# EAGLE design smoothieboard_daugterboard_template (EAGLE 7.2.0)
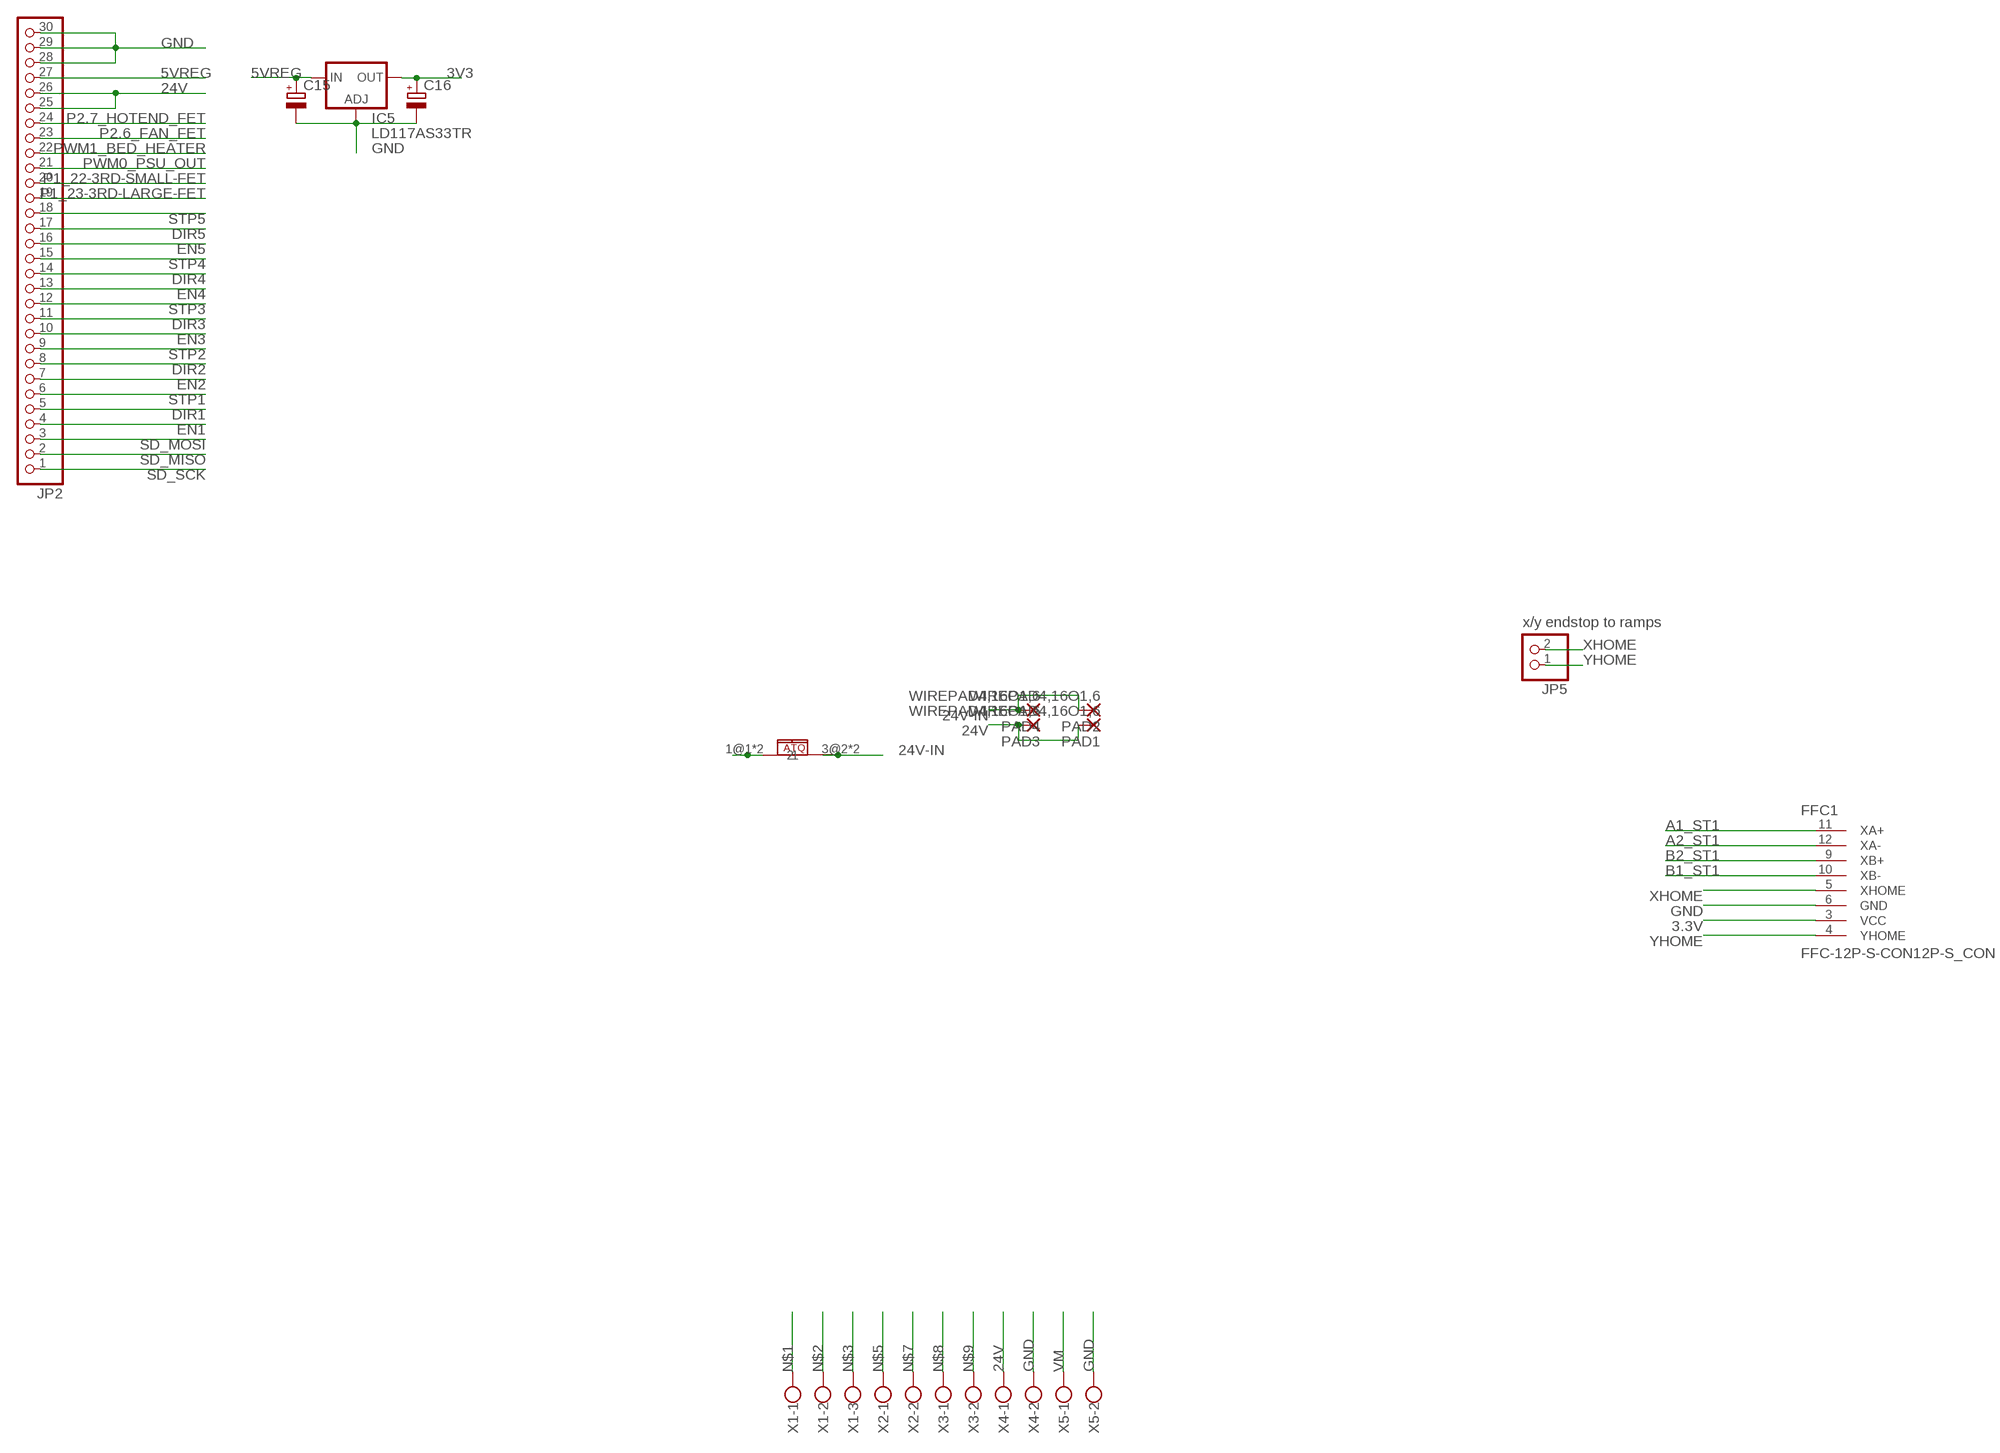
[diagram p0: schematic, sheet 1]

## Parts
C15  CPOL-EUE2.5-7  [E2,5-7]
C16  CPOL-EUE2.5-6  [E2,5-6]
FFC1  FFC-12P-S-CON12P-S_CON  [FFC]
IC5  LD117AS33TR  [SOT223]
JP2  PINHD-1X30  [1X30]
JP5  PINHD-1X2  [1X02]
PAD1  WIREPAD4,16O1,6  [4,16O1,6]
PAD2  WIREPAD4,16O1,6  [4,16O1,6]
PAD3  WIREPAD4,16O1,6  [4,16O1,6]
PAD4  WIREPAD4,16O1,6  [4,16O1,6]
U$7  CQ-121  [CQ121]
X1  W237-103  [W237-103]
X2  W237-102  [W237-102]
X3  W237-102  [W237-102]
X4  W237-102  [W237-102]
X5  W237-102  [W237-102]

## Nets
3.3V: FFC1.3(VCC)
3V3: C16.+ IC5.4(OUT)
5VREG: C15.+ IC5.3(IN) JP2.27
24V: JP2.25 JP2.26 PAD1.1(P) PAD3.1(P) X4.1
24V-IN: PAD2.1(P) PAD4.1(P) U$7.3@2 U$7.4@2
A1_ST1: FFC1.11(XA+)
A2_ST1: FFC1.12(XA-)
B1_ST1: FFC1.10(XB-)
B2_ST1: FFC1.9(XB+)
DIR1: JP2.5
DIR2: JP2.8
DIR3: JP2.11
DIR4: JP2.14
DIR5: JP2.17
EN1: JP2.4
EN2: JP2.7
EN3: JP2.10
EN4: JP2.13
EN5: JP2.16
GND: C15.- C16.- FFC1.6(GND) IC5.1(ADJ) JP2.28 JP2.29 JP2.30 X4.2 X5.2
N$1: X1.1
N$2: X1.2
N$3: X1.3
N$5: X2.1
N$7: X2.2
N$8: X3.1
N$9: X3.2
P1_22-3RD-SMALL-FET: JP2.20
P1_23-3RD-LARGE-FET: JP2.19
P2.6_FAN_FET: JP2.23
P2.7_HOTEND_FET: JP2.24
PWM0_PSU_OUT: JP2.21
PWM1_BED_HEATER: JP2.22
SD_MISO: JP2.2
SD_MOSI: JP2.3
SD_SCK: JP2.1
STP1: JP2.6
STP2: JP2.9
STP3: JP2.12
STP4: JP2.15
STP5: JP2.18
VM: U$7.1@1 U$7.2@1 X5.1
XHOME: FFC1.5(XHOME) JP5.2
YHOME: FFC1.4(YHOME) JP5.1

## Notes on the sheet
- x/y endstop to ramps

## Library data of the parts
C15 C16 = rcl:CPOL-EU: POLARIZED CAPACITOR, European symbol
FFC1 = WeisTek:FFC-12P-S-CON
IC5 = v-reg:LD117A?*: Low drop fixed and adjustable positive voltage regulators 1 A Source: http://www.st.com/stonline/products/literature/ds/7194/ld1117axx.pdf
JP2 = pinhead:PINHD-1X30: PIN HEADER
JP5 = pinhead:PINHD-1X2: PIN HEADER
PAD1-PAD4 = wirepad:WIREPAD: Wire PAD connect wire on PCB
U$7 = Mantech.co.za:CQ-121
X1 = con-wago-500:W237-103: WAGO SCREW CLAMP; MPN: 237-103; OC_FARNELL: unknown; OC_NEWARK: 18M7116
X2-X5 = con-wago-500:W237-102: WAGO SCREW CLAMP; MPN: 237-102; OC_FARNELL: unknown; OC_NEWARK: 70K9898

## Net classes
1 power: width 0.6 mm, clearance 0.305 mm

## Board
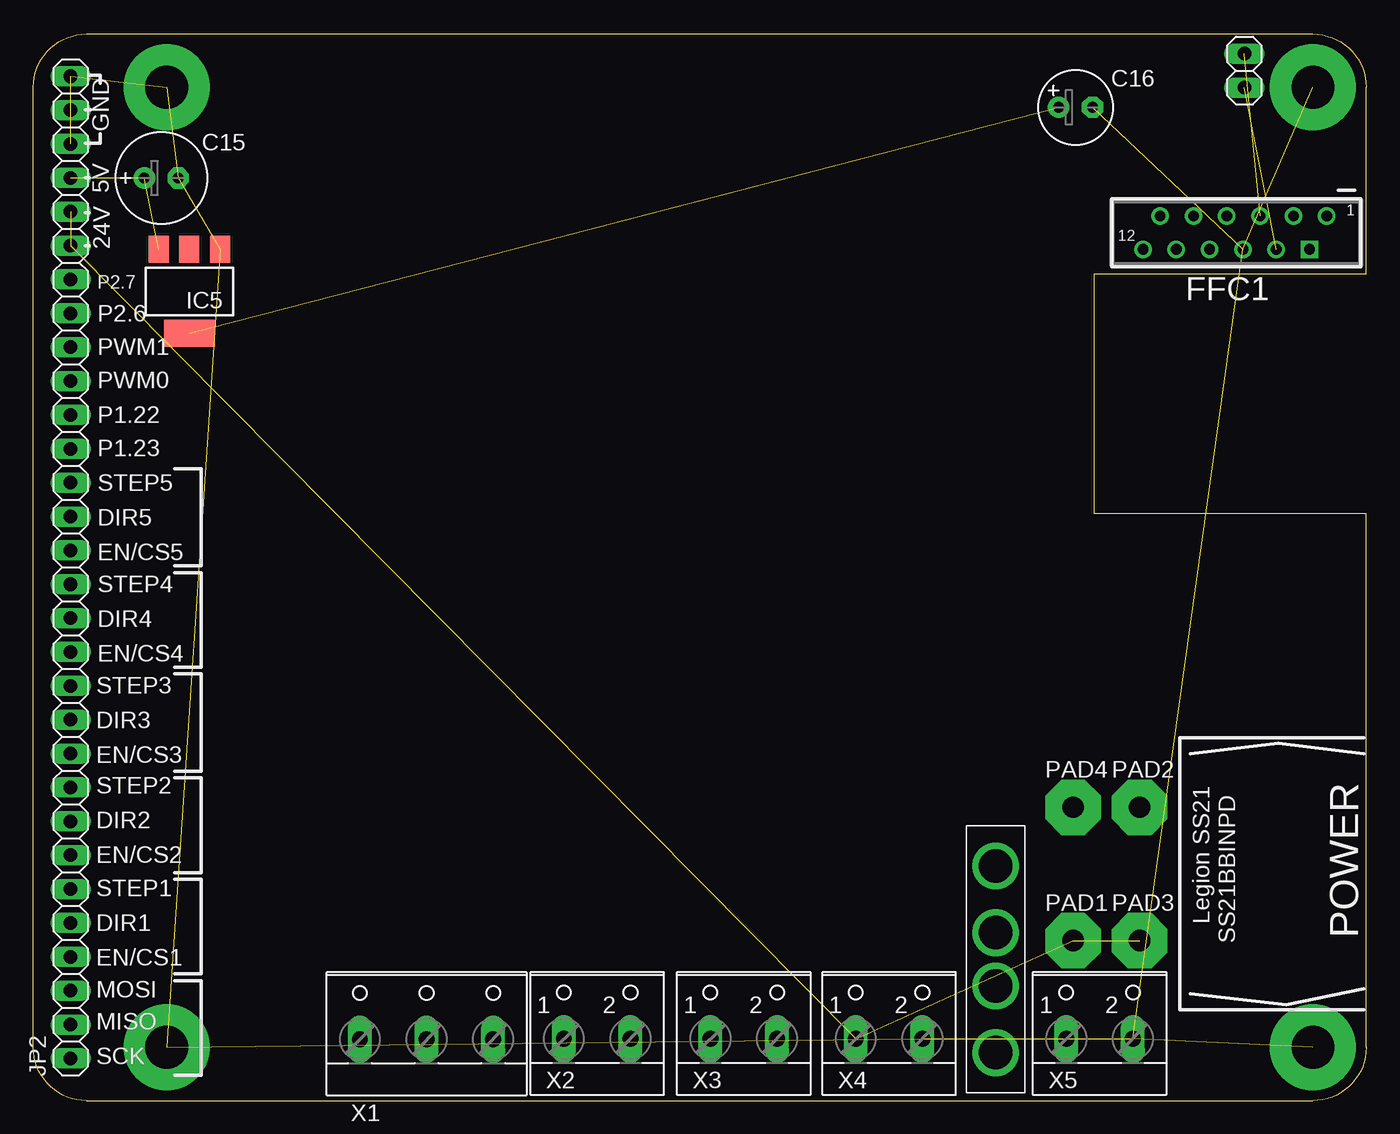
[diagram p1: board, top side]
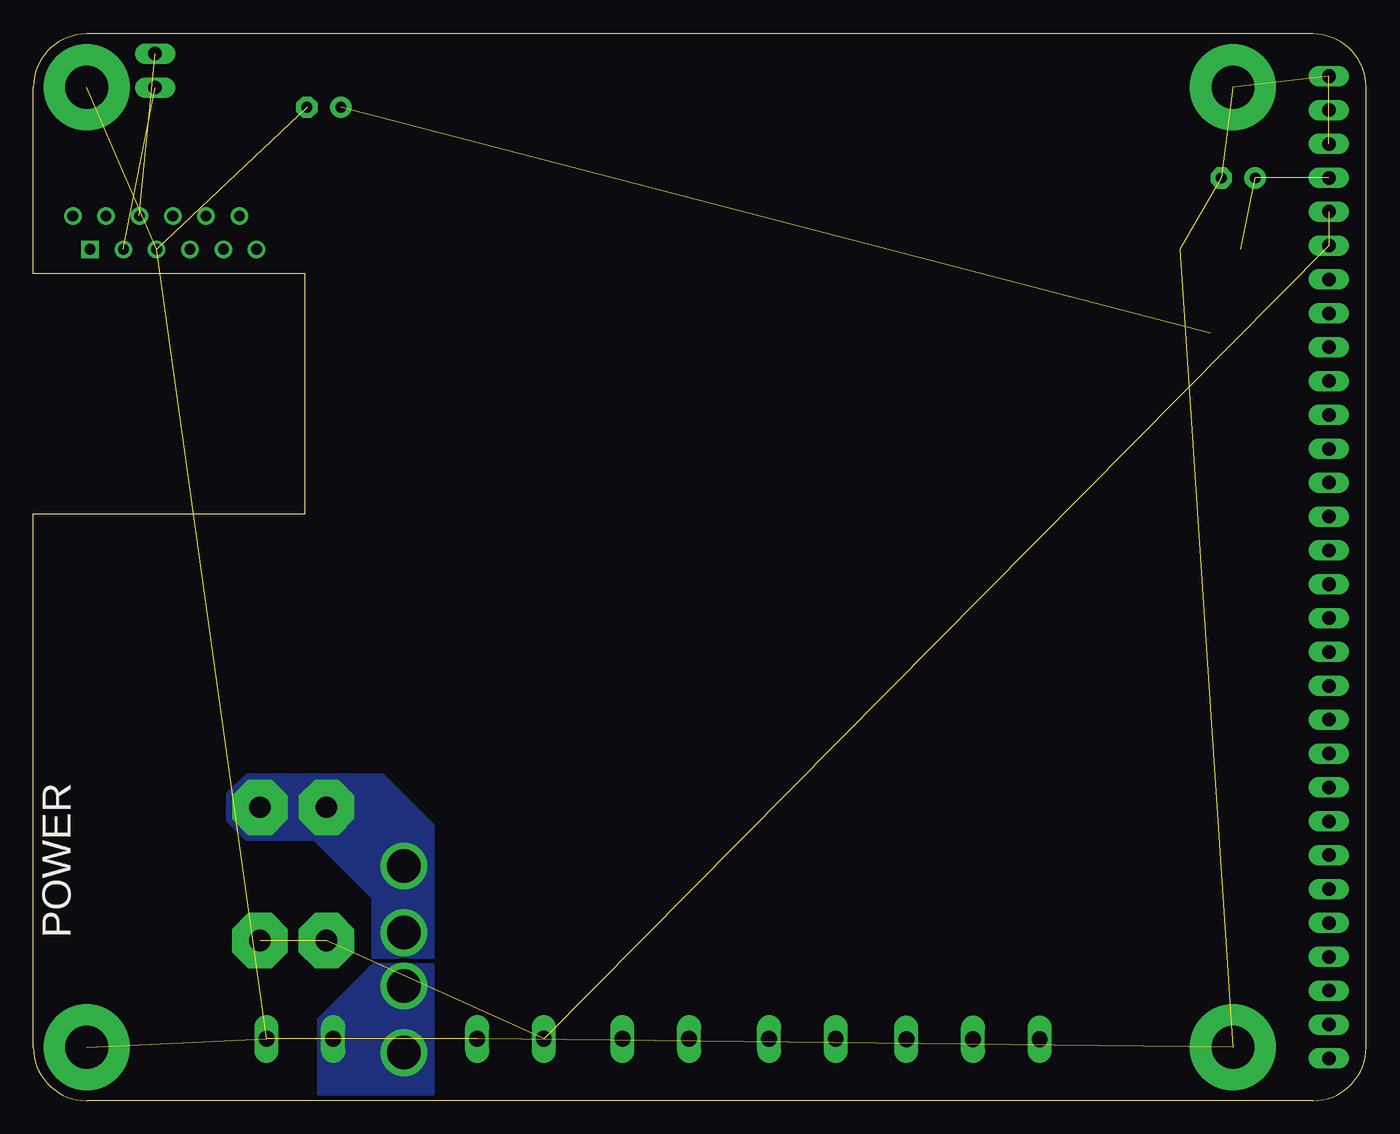
[diagram p2: board, bottom side, seen from below]

Size 100 x 80 mm. Coordinates in mm from the lower left corner, seen from the top.
Outline: 4,0 96,0 arc90 100,4 100,44 79.6,44 79.6,62 100,62 100,76 arc90 96,80 4,80 arc90 0,76 0,4 arc90 4,0
Copper layers (1*16): Top 0.035mm / dielectric 1.5mm / Bottom 0.035mm
Design rules "dirt_cheap_dirty_boards.v1": minimum track width 5mil, minimum drill 12mil, track to track 5mil, track to pad 5mil, pad to pad 5mil, via to via 5mil, smd to smd 0mil, copper to edge 10mil, drill to drill 10mil, minimum pad ring 10mil, minimum via ring 6mil, stop-mask expansion 2mil, vias tented up to drill 25mil, thermal gap 10mil

### Footprints (pad centres in the part's own frame; a part is rotated, then mirrored left to right if it is on the bottom)
E2,5-7 = drill 0.813 pad 1.6: + -1.27,0 | drill 0.813 pad 1.6 octagon: - 1.27,0
E2,5-6 = drill 0.813 pad 1.6: + -1.27,0 | drill 0.813 pad 1.6 octagon: - 1.27,0
FFC = drill 0.8: 1 6.77,1.25; 3 4.27,1.25; 4 2.98,-1.25; 5 1.77,1.25; 6 0.48,-1.25; 7 -0.73,1.25; 8 -2.02,-1.25; 9 -3.23,1.25; 10 -4.52,-1.25; 11 -5.73,1.25; 12 -7.02,-1.25 | drill 0.8 square: 2 5.48,-1.25
SOT223 = smd 1.5 x 2: 1 -2.3,-3.15; 2 0,-3.15; 3 2.3,-3.15 | smd 3.8 x 2: 4 0,3.15
1X30 = drill 1.016 long: 1 -36.83,0; 2 -34.29,0; 3 -31.75,0; 4 -29.21,0; 5 -26.67,0; 6 -24.13,0; 7 -21.59,0; 8 -19.05,0; 9 -16.51,0; 10 -13.97,0; 11 -11.43,0; 12 -8.89,0; 13 -6.35,0; 14 -3.81,0; 15 -1.27,0; 16 1.27,0; 17 3.81,0; 18 6.35,0; 19 8.89,0; 20 11.43,0; 21 13.97,0; 22 16.51,0; 23 19.05,0; 24 21.59,0; 25 24.13,0; 26 26.67,0; 27 29.21,0; 28 31.75,0; 29 34.29,0; 30 36.83,0
1X02 = drill 1.016 long: 1 -1.27,0; 2 1.27,0
4,16O1,6 = drill 1.6 pad 4.166 octagon: 1 0,0
CQ121 = drill 2.5: 1@1 -7,0; 2@1 -2,0; 3@2 2,0; 4@2 7,0
W237-103 = drill 1.194 long: 1 -5,-1.29; 2 0,-1.29; 3 5,-1.29
W237-102 = drill 1.194 long: 1 -2.5,-1.27; 2 2.5,-1.27

### Placement (x,y rotation side)
C15  9.6,69.2 0 top
C16  78.2,74.5 0 top
FFC1  90.27,65.1 0 top
IC5  11.7,60.7 180 top
JP2  2.8,40 90 top
JP5  90.86,77.26 90 top
PAD1  78,12 0 top
PAD2  83,22 0 top
PAD3  83,12 0 top
PAD4  78,22 0 top
U$7  72.2,10.6 90 top
X1  29.5,5.9 0 top
X2  42.3,5.9 0 top
X3  53.3,5.9 0 top
X4  64.2,5.9 0 top
X5  80,5.9 0 top

### Tracks (layer width: path | path; a pad name or v marks a point on that pad's centre or on a via)
3V3  (1 unrouted)
5VREG  (2 unrouted)
24V  (4 unrouted)
24V-IN
  pour Bottom (isolate 0.305, rank 2, no thermals): 70,10.6 74.5,10.6 74.5,15.2 78.9,19.6 84,19.6 85.4,21 85.4,23 84,24.4 73.8,24.4 70,20.6
GND  (via drill 3.2 pad 6.45)  (12 unrouted)
  other vias: 10,76 96,76 96,4 10,4
VM
  pour Bottom (isolate 0.305, no thermals): 70.1,10.2 74.5,10.2 78.6,6.1 78.6,0.5 70,0.5 70,10.1
XHOME  (1 unrouted)
YHOME  (1 unrouted)

### Text on the board
tPlace: GND | 5V | 24V | P2.7 | P2.6 | PWM1 | PWM0 | P1.22 | P1.23 | STEP5 | DIR5 | EN/CS5 | STEP4 | DIR4 | EN/CS4 | STEP3 | DIR3 | EN/CS3 | Legion SS21 | STEP2 | DIR2 | EN/CS2 | STEP1 | DIR1 | SS21BBINPD | POWER | EN/CS1 | MOSI | MISO | SCK
bPlace: POWER